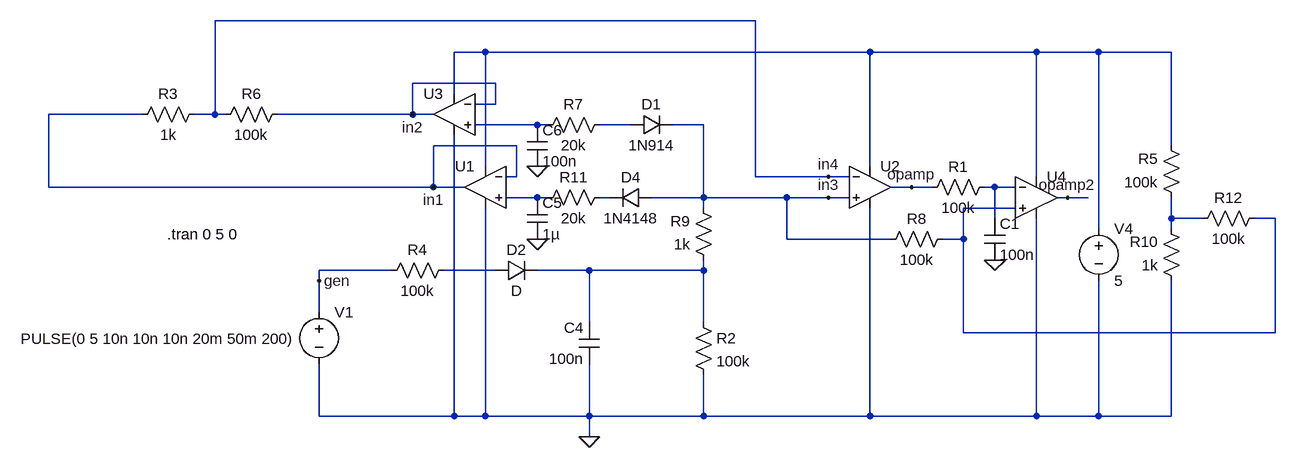
[diagram p0: schematic PWM_Test_OpAmp_Timeshift.asc]
PWM_Test_OpAmp_Timeshift.asc, the LTspice schematic file:
Version 4
SHEET 1 1988 680
WIRE -352 -544 -1184 -544
WIRE -768 -496 -816 -496
WIRE -176 -496 -768 -496
WIRE 80 -496 -176 -496
WIRE 176 -496 80 -496
WIRE 288 -496 176 -496
WIRE -752 -448 -880 -448
WIRE -816 -432 -816 -496
WIRE -752 -416 -752 -448
WIRE -752 -416 -784 -416
WIRE -1296 -400 -1440 -400
WIRE -1184 -400 -1184 -544
WIRE -1184 -400 -1216 -400
WIRE -1168 -400 -1184 -400
WIRE -880 -400 -880 -448
WIRE -880 -400 -1088 -400
WIRE -848 -400 -880 -400
WIRE -688 -384 -784 -384
WIRE -672 -384 -688 -384
WIRE -544 -384 -592 -384
WIRE -432 -384 -480 -384
WIRE -720 -352 -848 -352
WIRE 288 -352 288 -496
WIRE -768 -320 -768 -496
WIRE -176 -320 -176 -496
WIRE -720 -304 -720 -352
WIRE -720 -304 -736 -304
WIRE -352 -304 -352 -544
WIRE -240 -304 -352 -304
WIRE -208 -304 -240 -304
WIRE 80 -304 80 -496
WIRE -1440 -288 -1440 -400
WIRE -848 -288 -848 -352
WIRE -848 -288 -1440 -288
WIRE -800 -288 -848 -288
WIRE -112 -288 -144 -288
WIRE -80 -288 -112 -288
WIRE 16 -288 0 -288
WIRE 48 -288 16 -288
WIRE -688 -272 -736 -272
WIRE -672 -272 -688 -272
WIRE -576 -272 -592 -272
WIRE -432 -272 -432 -384
WIRE -432 -272 -512 -272
WIRE -304 -272 -432 -272
WIRE -240 -272 -304 -272
WIRE -208 -272 -240 -272
WIRE 128 -272 112 -272
WIRE 160 -272 128 -272
WIRE -432 -256 -432 -272
WIRE 48 -256 -32 -256
WIRE 16 -240 16 -288
WIRE 288 -240 288 -272
WIRE 336 -240 288 -240
WIRE 448 -240 416 -240
WIRE 176 -224 176 -496
WIRE 288 -224 288 -240
WIRE -304 -208 -304 -272
WIRE -144 -208 -304 -208
WIRE -32 -208 -32 -256
WIRE -32 -208 -64 -208
WIRE -912 -160 -1024 -160
WIRE -752 -160 -832 -160
WIRE -608 -160 -688 -160
WIRE -432 -160 -432 -176
WIRE -432 -160 -608 -160
WIRE -1024 -144 -1024 -160
WIRE -1024 -96 -1024 -144
WIRE -608 -80 -608 -160
WIRE -432 -80 -432 -160
WIRE -32 -64 -32 -208
WIRE 448 -64 448 -240
WIRE 448 -64 -32 -64
WIRE -1024 64 -1024 -16
WIRE -816 64 -816 -368
WIRE -816 64 -1024 64
WIRE -768 64 -768 -256
WIRE -768 64 -816 64
WIRE -608 64 -608 -16
WIRE -608 64 -768 64
WIRE -432 64 -432 0
WIRE -432 64 -608 64
WIRE -176 64 -176 -256
WIRE -176 64 -432 64
WIRE 80 64 80 -240
WIRE 80 64 -176 64
WIRE 176 64 176 -144
WIRE 176 64 80 64
WIRE 288 64 288 -144
WIRE 288 64 176 64
WIRE -608 96 -608 64
FLAG -608 96 0
FLAG -112 -288 opamp
FLAG -1024 -144 gen
FLAG -240 -304 in4
FLAG -240 -272 in3
FLAG -848 -288 in1
FLAG -688 -208 0
FLAG -880 -400 in2
FLAG -688 -320 0
FLAG 16 -176 0
FLAG 128 -272 opamp2
SYMBOL voltage -1024 -112 R0
WINDOW 3 -459 57 Left 2
WINDOW 123 24 124 Left 2
WINDOW 39 0 0 Left 0
SYMATTR InstName V1
SYMATTR Value PULSE(0 5 10n 10n 10n 20m 50m 200)
SYMBOL res -816 -176 R90
WINDOW 0 0 56 VBottom 2
WINDOW 3 32 56 VTop 2
SYMATTR InstName R4
SYMATTR Value 100k
SYMBOL diode -752 -144 R270
WINDOW 0 32 32 VTop 2
WINDOW 3 0 32 VBottom 2
SYMATTR InstName D2
SYMBOL cap -592 -16 R180
WINDOW 0 24 56 Left 2
WINDOW 3 24 8 Left 2
SYMATTR InstName C4
SYMATTR Value 100n
SYMBOL res -448 -96 R0
SYMATTR InstName R2
SYMATTR Value 100k
SYMBOL voltage 176 -240 R0
WINDOW 123 0 0 Left 0
WINDOW 39 0 0 Left 0
SYMATTR InstName V4
SYMATTR Value 5
SYMBOL Opamps\\UniversalOpamp2 -176 -288 R0
SYMATTR InstName U2
SYMBOL res -1200 -416 R90
WINDOW 0 0 56 VBottom 2
WINDOW 3 32 56 VTop 2
SYMATTR InstName R3
SYMATTR Value 1k
SYMBOL res -1072 -416 R90
WINDOW 0 0 56 VBottom 2
WINDOW 3 32 56 VTop 2
SYMATTR InstName R6
SYMATTR Value 100k
SYMBOL Opamps\\UniversalOpamp2 -816 -400 M0
SYMATTR InstName U3
SYMBOL res -576 -400 R90
WINDOW 0 0 56 VBottom 2
WINDOW 3 32 56 VTop 2
SYMATTR InstName R7
SYMATTR Value 20k
SYMBOL res -416 -160 R180
WINDOW 0 36 76 Left 2
WINDOW 3 36 40 Left 2
SYMATTR InstName R9
SYMATTR Value 1k
SYMBOL diode -512 -288 R90
WINDOW 0 0 32 VBottom 2
WINDOW 3 32 32 VTop 2
SYMATTR InstName D4
SYMATTR Value 1N4148
SYMBOL Opamps\\UniversalOpamp2 -768 -288 M0
SYMATTR InstName U1
SYMBOL res -576 -288 R90
WINDOW 0 0 56 VBottom 2
WINDOW 3 32 56 VTop 2
SYMATTR InstName R11
SYMATTR Value 20k
SYMBOL cap -704 -272 R0
SYMATTR InstName C5
SYMATTR Value 1µ
SYMBOL diode -544 -368 R270
WINDOW 0 32 32 VTop 2
WINDOW 3 0 32 VBottom 2
SYMATTR InstName D1
SYMATTR Value 1N914
SYMBOL cap -704 -384 R0
SYMATTR InstName C6
SYMATTR Value 100n
SYMBOL Opamps\\UniversalOpamp2 80 -272 R0
SYMATTR InstName U4
SYMBOL res 16 -304 R90
WINDOW 0 0 56 VBottom 2
WINDOW 3 32 56 VTop 2
SYMATTR InstName R1
SYMATTR Value 100k
SYMBOL cap 0 -240 R0
SYMATTR InstName C1
SYMATTR Value 100n
SYMBOL res -48 -224 R90
WINDOW 0 0 56 VBottom 2
WINDOW 3 32 56 VTop 2
SYMATTR InstName R8
SYMATTR Value 100k
SYMBOL res 304 -256 R180
WINDOW 0 36 76 Left 2
WINDOW 3 36 40 Left 2
SYMATTR InstName R5
SYMATTR Value 100k
SYMBOL res 304 -128 R180
WINDOW 0 36 76 Left 2
WINDOW 3 36 40 Left 2
SYMATTR InstName R10
SYMATTR Value 1k
SYMBOL res 432 -256 R90
WINDOW 0 0 56 VBottom 2
WINDOW 3 32 56 VTop 2
SYMATTR InstName R12
SYMATTR Value 100k
TEXT -1258 -216 Left 2 !.tran 0 5 0

The netlist it stands for:
* PWM_Test_OpAmp_Timeshift.asc
V1 gen 0 PULSE(0 5 10n 10n 10n 20m 50m 200)
R4 N009 gen 100k
D2 N009 N010 D
C4 0 N010 100n
R2 N010 0 100k
V4 N001 0 5
XU2 in3 in4 N001 0 opamp level.2 Avol=1Meg GBW=10Meg Slew=10Meg ilimit=25m rail=0 Vos=0 phimargin=45 en=0 enk=0 in=0 ink=0 Rin=500Meg  ; pins IN+ IN- V+ V- OUT
R3 in4 in1 1k
R6 in2 in4 100k
XU3 N002 in2 N001 0 in2 level.2 Avol=1Meg GBW=10Meg Slew=10Meg ilimit=25m rail=0 Vos=0 phimargin=45 en=0 enk=0 in=0 ink=0 Rin=500Meg  ; pins IN+ IN- V+ V- OUT
R7 N003 N002 20k
R9 N010 in3 1k
D4 in3 N006 1N4148
XU1 N005 in1 N001 0 in1 level.2 Avol=1Meg GBW=10Meg Slew=10Meg ilimit=25m rail=0 Vos=0 phimargin=45 en=0 enk=0 in=0 ink=0 Rin=500Meg  ; pins IN+ IN- V+ V- OUT
R11 N006 N005 20k
C5 N005 0 1µ
D1 N003 in3 1N914
C6 N002 0 100n
XU4 N007 N004 N001 0 opamp2 level.2 Avol=1Meg GBW=10Meg Slew=10Meg ilimit=25m rail=0 Vos=0 phimargin=45 en=0 enk=0 in=0 ink=0 Rin=500Meg  ; pins IN+ IN- V+ V- OUT
R1 N004 opamp 100k
C1 N004 0 100n
R8 N007 in3 100k
R5 N008 N001 100k
R10 0 N008 1k
R12 N007 N008 100k
.model D D
.lib standard.dio
.tran 0 5 0
.lib UniversalOpamps2.sub
.backanno
.end